# Altium schematic sheet ATSAMD10-XMINI_Target.SchDoc: ATSAMD10-XMINI
size A3; Organization: ATMEL Norway; Address1: Vestre Rosten 79; Address2: N-7075 TILLER; Address3: NORWAY; DocumentNumber: A09-2378; Revision: 2; SheetNumber: 2; SheetTotal: 3; PageSetup: Record=PageOptions|CenterHorizontal=True|CenterVertical=True|PrintScale=1.01|XCorrection=1.00|YCorrection=1.00|PrintKind=1|BorderSize=5000000|LeftOffset=0|BottomOffset=0|Orientation=2|PaperLength=1000|PaperWidth=1000|Scale=100|PaperSource=7|PrintQuality=-4|MediaType=1|DitherType=10|PaperKind=A3 (297 x 420 mm)|PrintScaleMode=1
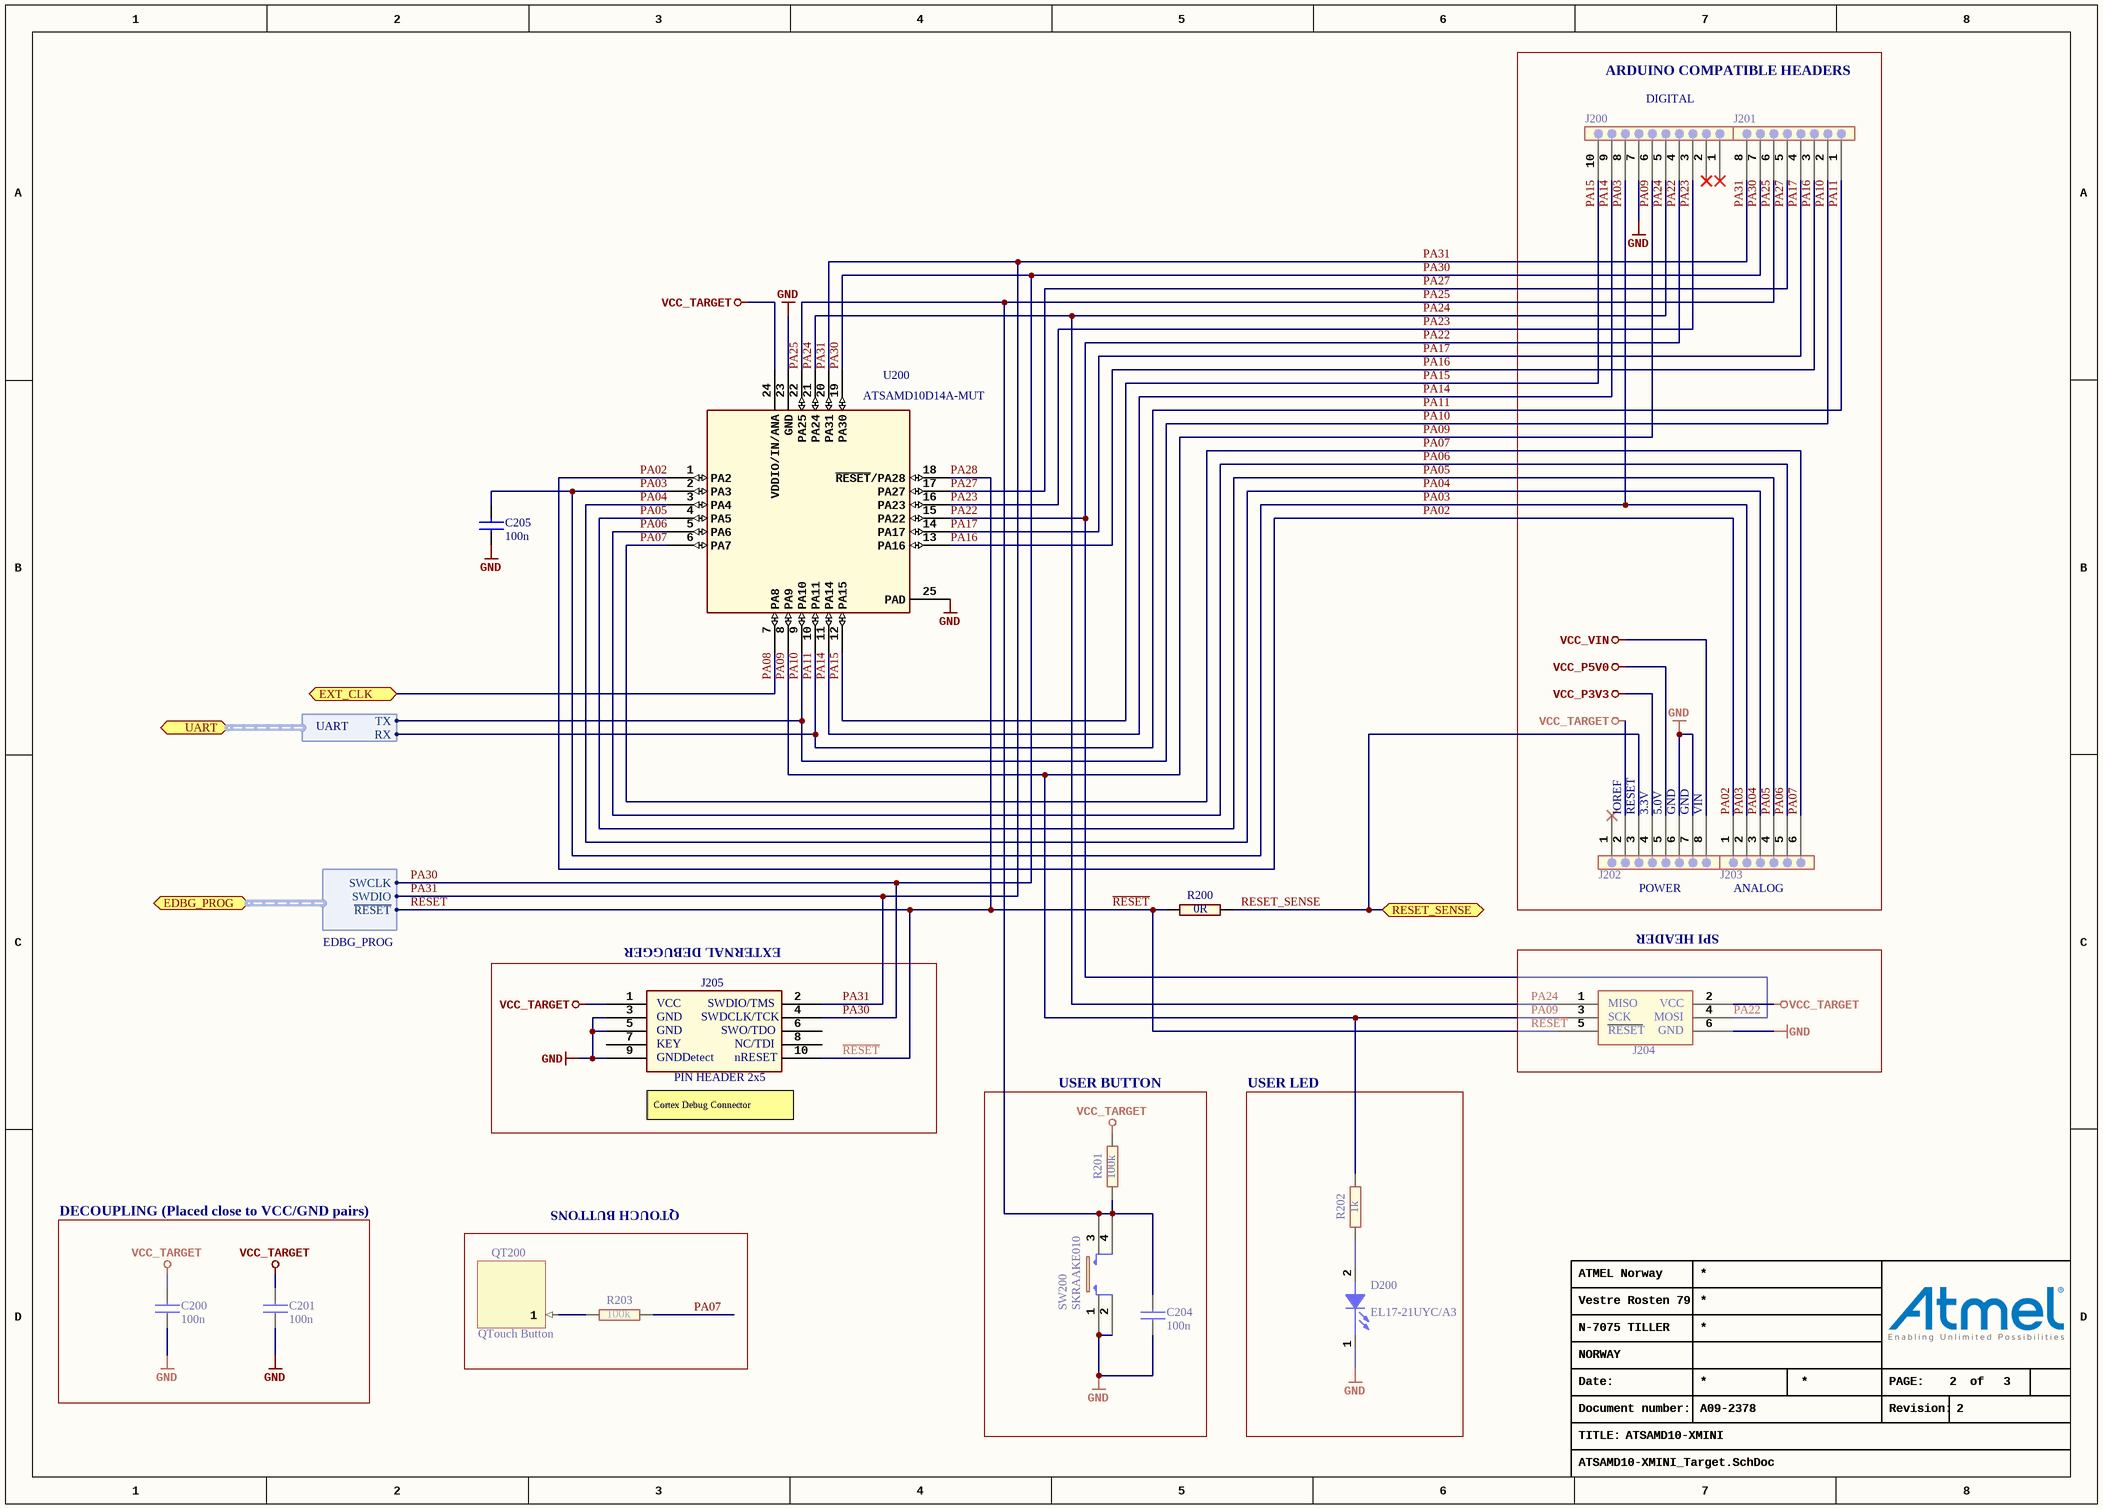
[diagram p0: ATSAMD10-XMINI_Target.SchDoc]

## Parts
C200  value 100n  [AP1-00001]
C201  value 100n  [AP1-00001]
C204  value 100n  [AP1-00001]
C205  value 100n  [AP1-00001]
D200  value EL17-21UYC/A3  [AP4-00013]
J200  (no value)  [AP8-00822]
J201  (no value)  [AP8-00823]
J202  (no value)  [AP8-00823]
J203  (no value)  [AP8-00824]
J204  (no value)  [AP8-00182]
J205  value PIN HEADER 2x5  [AP8-00257]
QT200  QTouch Button  (no BOM)
R200  value 0R  [AP2-00000]
R201  value 100k  [AP2-00000]
R202  value 1k  [AP2-00000]
R203  value 100k  [AP2-00000]
SW200  value SKRAAKE010  [AP8-00137]
U200  value ATSAMD10D14A-MUT  [AP6-00371]

## Blocks framed on the sheet
ARDUINO COMPATIBLE HEADERS: J200-J203
USER BUTTON: C204 R201 SW200
USER LED: D200 R202
DECOUPLING (Placed close to VCC/GND pairs): C200 C201

## Ports
EDBG_PROG (harness EDBG_PROG), EXT_CLK (bidir), RESET_SENSE, UART (harness UART)

## Harnesses
EDBG_PROG: ~{RESET}, SWDIO, SWCLK
UART: RX, TX

## Nets
GND: C200.1 C201.1 C204.1 C205.1 D200.1(CATHODE) J200.7 J202.6 J202.7 J204.6 J205.3 J205.5 J205.9 SW200.1 SW200.2 U200.23(GND) U200.25(PAD)
VCC_P3V3: J202.4
VCC_P5V0: J202.5
VCC_TARGET: C200.2 C201.2 J202.2 J204.2 J205.1 R201.2 U200.24(VDDIO/IN/ANA)
VCC_VIN: J202.8
PA02: J203.1 U200.1(PA2)
PA03: C205.2 J200.8 J203.2 U200.2(PA3)
PA04: J203.3 U200.3(PA4)
PA05: J203.4 U200.4(PA5)
PA06: J203.5 U200.5(PA6)
PA07: J203.6 R203.2 U200.6(PA7)
PA08: U200.7(PA8) ; port EXT_CLK
PA09: J200.6 J204.3 R202.2 U200.8(PA9)
PA10: J201.2 U200.9(PA10) ; port UART.TX
PA11: J201.1 U200.10(PA11) ; port UART.RX
PA14: J200.9 U200.11(PA14)
PA15: J200.10 U200.12(PA15)
PA16: J201.3 U200.13(PA16)
PA17: J201.4 U200.14(PA17)
PA22: J200.4 J204.4 U200.15(PA22)
PA23: J200.3 U200.16(PA23)
PA24: J200.5 J204.1 U200.21(PA24)
PA25: C204.2 J201.6 R201.1 SW200.3 SW200.4 U200.22(PA25)
PA27: J201.5 U200.17(PA27)
PA28: J204.5 J205.10 R200.1 U200.18(~{RESET}/PA28) ; port EDBG_PROG.~{RESET}  [also labelled ~{RESET}]
PA30: J201.7 J205.4 U200.19(PA30) ; port EDBG_PROG.SWCLK
PA31: J201.8 J205.2 U200.20(PA31) ; port EDBG_PROG.SWDIO
RESET_SENSE: J202.3 R200.2 ; port RESET_SENSE
NetD200_2: D200.2(ANODE) R202.1
NetQT200_1: QT200.1 R203.1

Not connected (* = marked no-connect by the designer): J200 1* 2*; J202 1*; J205 6 7 8

## Notes on the sheet
- (near J200) DIGITAL
- (near J202) IOREF
- (near J202) RESET
- (near J202) 3.3V
- (near J202) 5.0V
- (near J202) GND
- GND
- VIN
- (near J202) POWER
- ANALOG
- (near J205) EXTERNAL DEBUGGER
- SPI HEADER
- (near J205) Cortex Debug Connector
- QTOUCH BUTTONS
- Date:
- PAGE:
- of
- TITLE:
- Document number:
- Revision:
- (in symbol A08-0385) VCC; SWDIO/TMS; GND; SWDCLK/TCK; SWO/TDO; KEY; NC/TDI; GNDDetect; nRESET
- (in symbol A08-0538) MISO; VCC; SCK; MOSI; RESET; GND

## Library data of the parts
C200 C201 C204 C205 = A01-0246: Ceramic capacitor, SMD 0402, X7R, 16V, +/-10%; PartGroup: Capacitors,Ceramic,SMD 0402; Manufacturer: Kemet; MPN: C0402C104K4RACTU; TemperatureRange: -55 - +125 deg C; AN: A01-0246; Tolerance: 16V, +/-10%; Height: 0,5
D200 = A10-0019: LED, Yellow, Wave length=591nm, SMD 0805, ±70°; PartGroup: Opto,LEDs,SMD; Manufacturer: Everlight; MPN: 17-21UYC/S530-A3/TR8; TemperatureRange: -40 to +85 deg C; AN: A10-0019; Height: 1,10000002384186
J200 = A08-2026: 1x10 receptacle pin header, low insertion force, 2.54mm pitch THM, Pin in Paste; PartGroup: Mechanical devices,Connectors,Pin header receptacle; Manufacturer: SAMTEC; Value: SSQ-110-21-F-S; AN: A08-2026; Height: 8,51000022888184; MPN: SSQ-110-21-F-S
J201 J202 = A08-2025: 1x8 receptacle pin header, low insertion force, 2.54mm pitch THM, Pin in Paste; PartGroup: Mechanical devices,Connectors,Pin header receptacle; Manufacturer: SAMTEC; Value: SSQ-108-21-F-S; AN: A08-2025; Height: 8,51000022888184; MPN: SSQ-108-21-F-S
J203 = A08-2024: 1x6 receptacle pin header, low insertion force, 2.54mm pitch THM; PartGroup: Mechanical devices,Connectors,Pin header receptacle; Manufacturer: SAMTEC; Value: SSQ-106-21-F-S; AN: A08-2024; Height: 8,51000022888184; MPN: SSQ-106-21-F-S
J204 = A08-0538: 2x3 pin header, 2.54 mm pitch, THM; PartGroup: Mechanical devices,Connectors,Pin headers; Manufacturer: SAMTEC; Value: MTSW-103-08-L-D-276; TemperatureRange: max. 125 degrees; AN: A08-0538; Height: 9,60000038146973; MPN: MTSW-103-08-L-D-276
J205 = A08-0385: 2x5 pin header, 1.27mm pitch, THM; PartGroup: Mechanical devices,Connectors,Pin headers; Manufacturer: Garry; MPN: 176-2-010-0-T-XS0-0730; AN: A08-0385; Height: 7,30000019073486
QT200 = QTouchButton: ConfiguratorName: ATMEL_TOUCH; ConfigurationParameters: {}__sensorid[1]{}width[8]{}height[8]{}
R200 = A02-0163: RES 0.0 OHM 1/16W 0402 SMD; PartGroup: Resistors,SMD,0402 1%; Manufacturer: (n/a); MPN: RMCF0402ZT0R00; Tolerance: 1 %; TemperatureRange: -55 - +125 deg C; AN: A02-0163; Height: 0,349999994039536
R201 R203 = A02-0260: Thick film resistor, SMD 0402, 1/16W, 1%; PartGroup: Resistors,SMD,0402 1%; Manufacturer: ASJ; MPN: CR10-1003-FK; TemperatureRange: -55ï¿½ to +125ï¿½C; AN: A02-0260; Tolerance: 1 %; Height: 0,349999994039536
R202 = A02-0212: Thick film resistor, SMD 0402, 1/16W, 1%; PartGroup: Resistors,SMD,0402 1%; Manufacturer: ASJ; MPN: CR10-1001-FK; TemperatureRange: -55 - +125 deg C; AN: A02-0212; Tolerance: 1 %; Height: 0,349999994039536
SW200 = A08-0790: 6.2x6.2 mm SMD tact switch, same as A08-0091 but less force is needed; PartGroup: Mechanical devices,Switches,SMD; Manufacturer: ALPS; TemperatureRange: -30 - +90 deg C; AN: A08-0790; Height: 5,09999990463257; MPN: SKRAAKE010
U200 = A06-1148: Atmel 32-bit RISC MCU; PartGroup: Integrated Circuits,MCU, MPU, DSP,ARM MCU; AN: A06-1148; Height: 1,20000004768372; Manufacturer: ATMEL; MPN: ATSAMD10D14A-MUT